# EAGLE schematic matrix scanner (EAGLE 6.2)
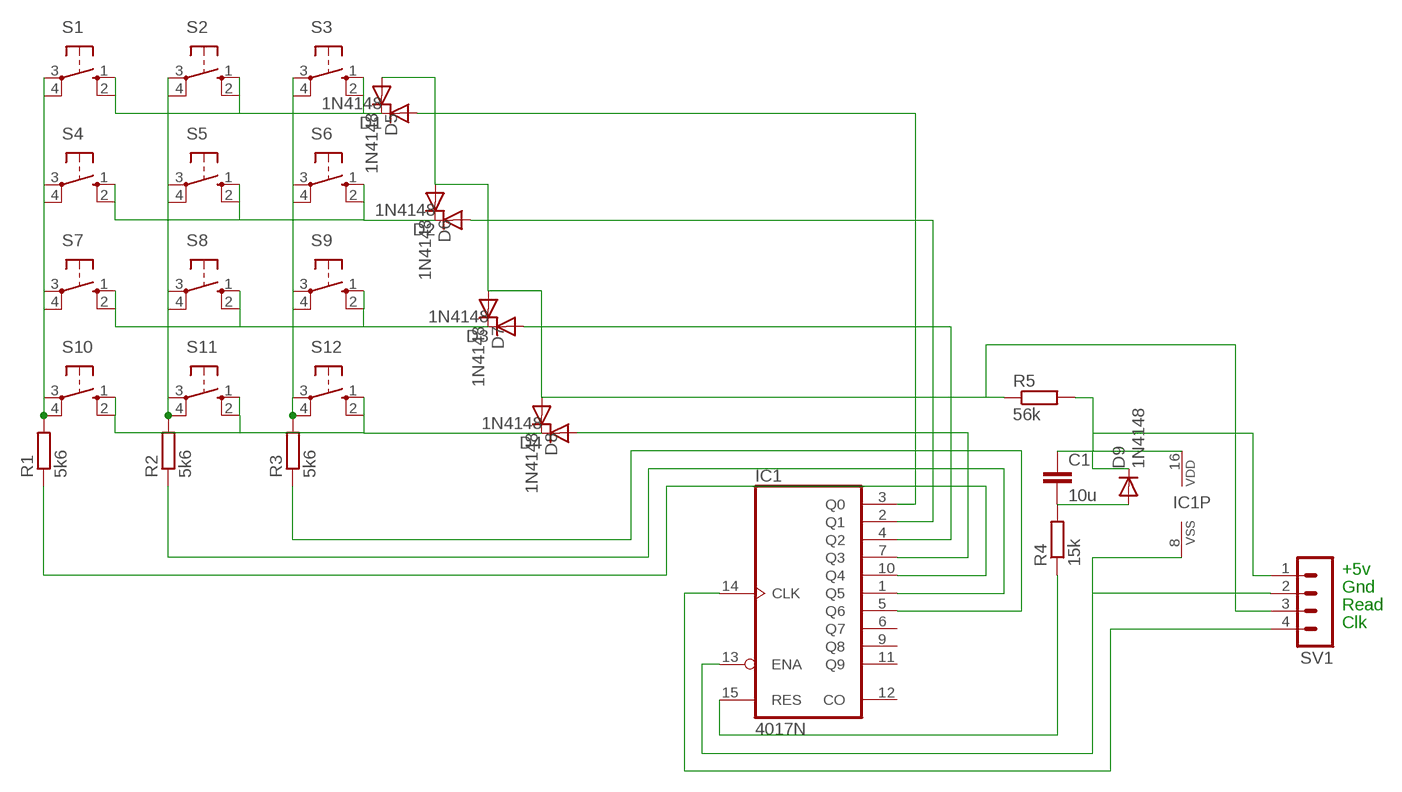
[diagram p0: schematic, sheet 1]

## Parts
C1  10u  C-EU025-050X050  [C025-050X050]
D1  1N4148  1N4148DO35-7  [DO35-7]
D2  1N4148  1N4148DO35-7  [DO35-7]
D3  1N4148  1N4148DO35-7  [DO35-7]
D4  1N4148  1N4148DO35-7  [DO35-7]
D5  1N4148  1N4148DO35-7  [DO35-7]
D6  1N4148  1N4148DO35-7  [DO35-7]
D7  1N4148  1N4148DO35-7  [DO35-7]
D8  1N4148  1N4148DO35-7  [DO35-7]
D9  1N4148  1N4148DO35-7  [DO35-7]
IC1  4017N  [DIL16]
R1  5k6  R-EU_0204/7  [0204/7]
R2  5k6  R-EU_0204/7  [0204/7]
R3  5k6  R-EU_0204/7  [0204/7]
R4  15k  R-EU_0204/7  [0204/7]
R5  56k  R-EU_0204/7  [0204/7]
S1  10-XX  [B3F-10XX]
S2  10-XX  [B3F-10XX]
S3  10-XX  [B3F-10XX]
S4  10-XX  [B3F-10XX]
S5  10-XX  [B3F-10XX]
S6  10-XX  [B3F-10XX]
S7  10-XX  [B3F-10XX]
S8  10-XX  [B3F-10XX]
S9  10-XX  [B3F-10XX]
S10  10-XX  [B3F-10XX]
S11  10-XX  [B3F-10XX]
S12  10-XX  [B3F-10XX]
SV1  MA04-1  [MA04-1]

## Nets
N$1: R1.2 S1.3(P) S1.4(P1) S4.3(P) S4.4(P1) S7.3(P) S7.4(P1) S10.3(P) S10.4(P1)
N$2: R2.2 S2.3(P) S2.4(P1) S5.3(P) S5.4(P1) S8.3(P) S8.4(P1) S11.3(P) S11.4(P1)
N$3: R3.2 S3.3(P) S3.4(P1) S6.3(P) S6.4(P1) S9.3(P) S9.4(P1) S12.3(P) S12.4(P1)
N$4: D4.A IC1.7(Q3)
N$5: D2.C D6.C S4.1(S) S4.2(S1) S5.1(S) S5.2(S1) S6.1(S) S6.2(S1)
N$6: D1.C D5.C S1.1(S) S1.2(S1) S2.1(S) S2.2(S1) S3.1(S) S3.2(S1)
N$7: D3.C D7.C S7.1(S) S7.2(S1) S8.1(S) S8.2(S1) S9.1(S) S9.2(S1)
N$8: IC1.10(Q4) R1.1
N$9: IC1.1(Q5) R2.1
N$10: IC1.5(Q6) R3.1
N$11: D4.C D8.C S10.1(S) S10.2(S1) S11.1(S) S11.2(S1) S12.1(S) S12.2(S1)
N$12: D5.A D6.A D7.A D8.A R5.1 SV1.3
N$13: D1.A IC1.3(Q0)
N$14: D2.A IC1.2(Q1)
N$15: D3.A IC1.4(Q2)
N$16: C1.1 D9.C IC1.16(VDD) R5.2 SV1.1
N$17: IC1.8(VSS) IC1.13(ENA) SV1.2
N$18: IC1.14(CLK) SV1.4
N$19: C1.2 D9.A R4.2
N$20: IC1.15(RES) R4.1
Unconnected: IC1.6(Q7) IC1.9(Q8) IC1.11(Q9) IC1.12(CO)

## Notes on the sheet
- +5v
- Gnd
- Read
- Clk

## Library data of the parts
C1 = resistor:C-EU: CAPACITOR, European symbol
D1-D9 = diode:1N4148: DIODE high speed (Philips)
IC1 = 40xx:4017: COUNTER/DIVIDER
R1-R5 = resistor:R-EU_: RESISTOR, European symbol
S1-S12 = switch-omron:10-XX: OMRON SWITCH; MPN: B3F-1000; OC_FARNELL: 176432; OC_NEWARK: 36M3542
SV1 = con-lstb:MA04-1: PIN HEADER; OC_FARNELL: unknown; OC_NEWARK: unknown